# EAGLE design Rat (EAGLE 9.2.2)
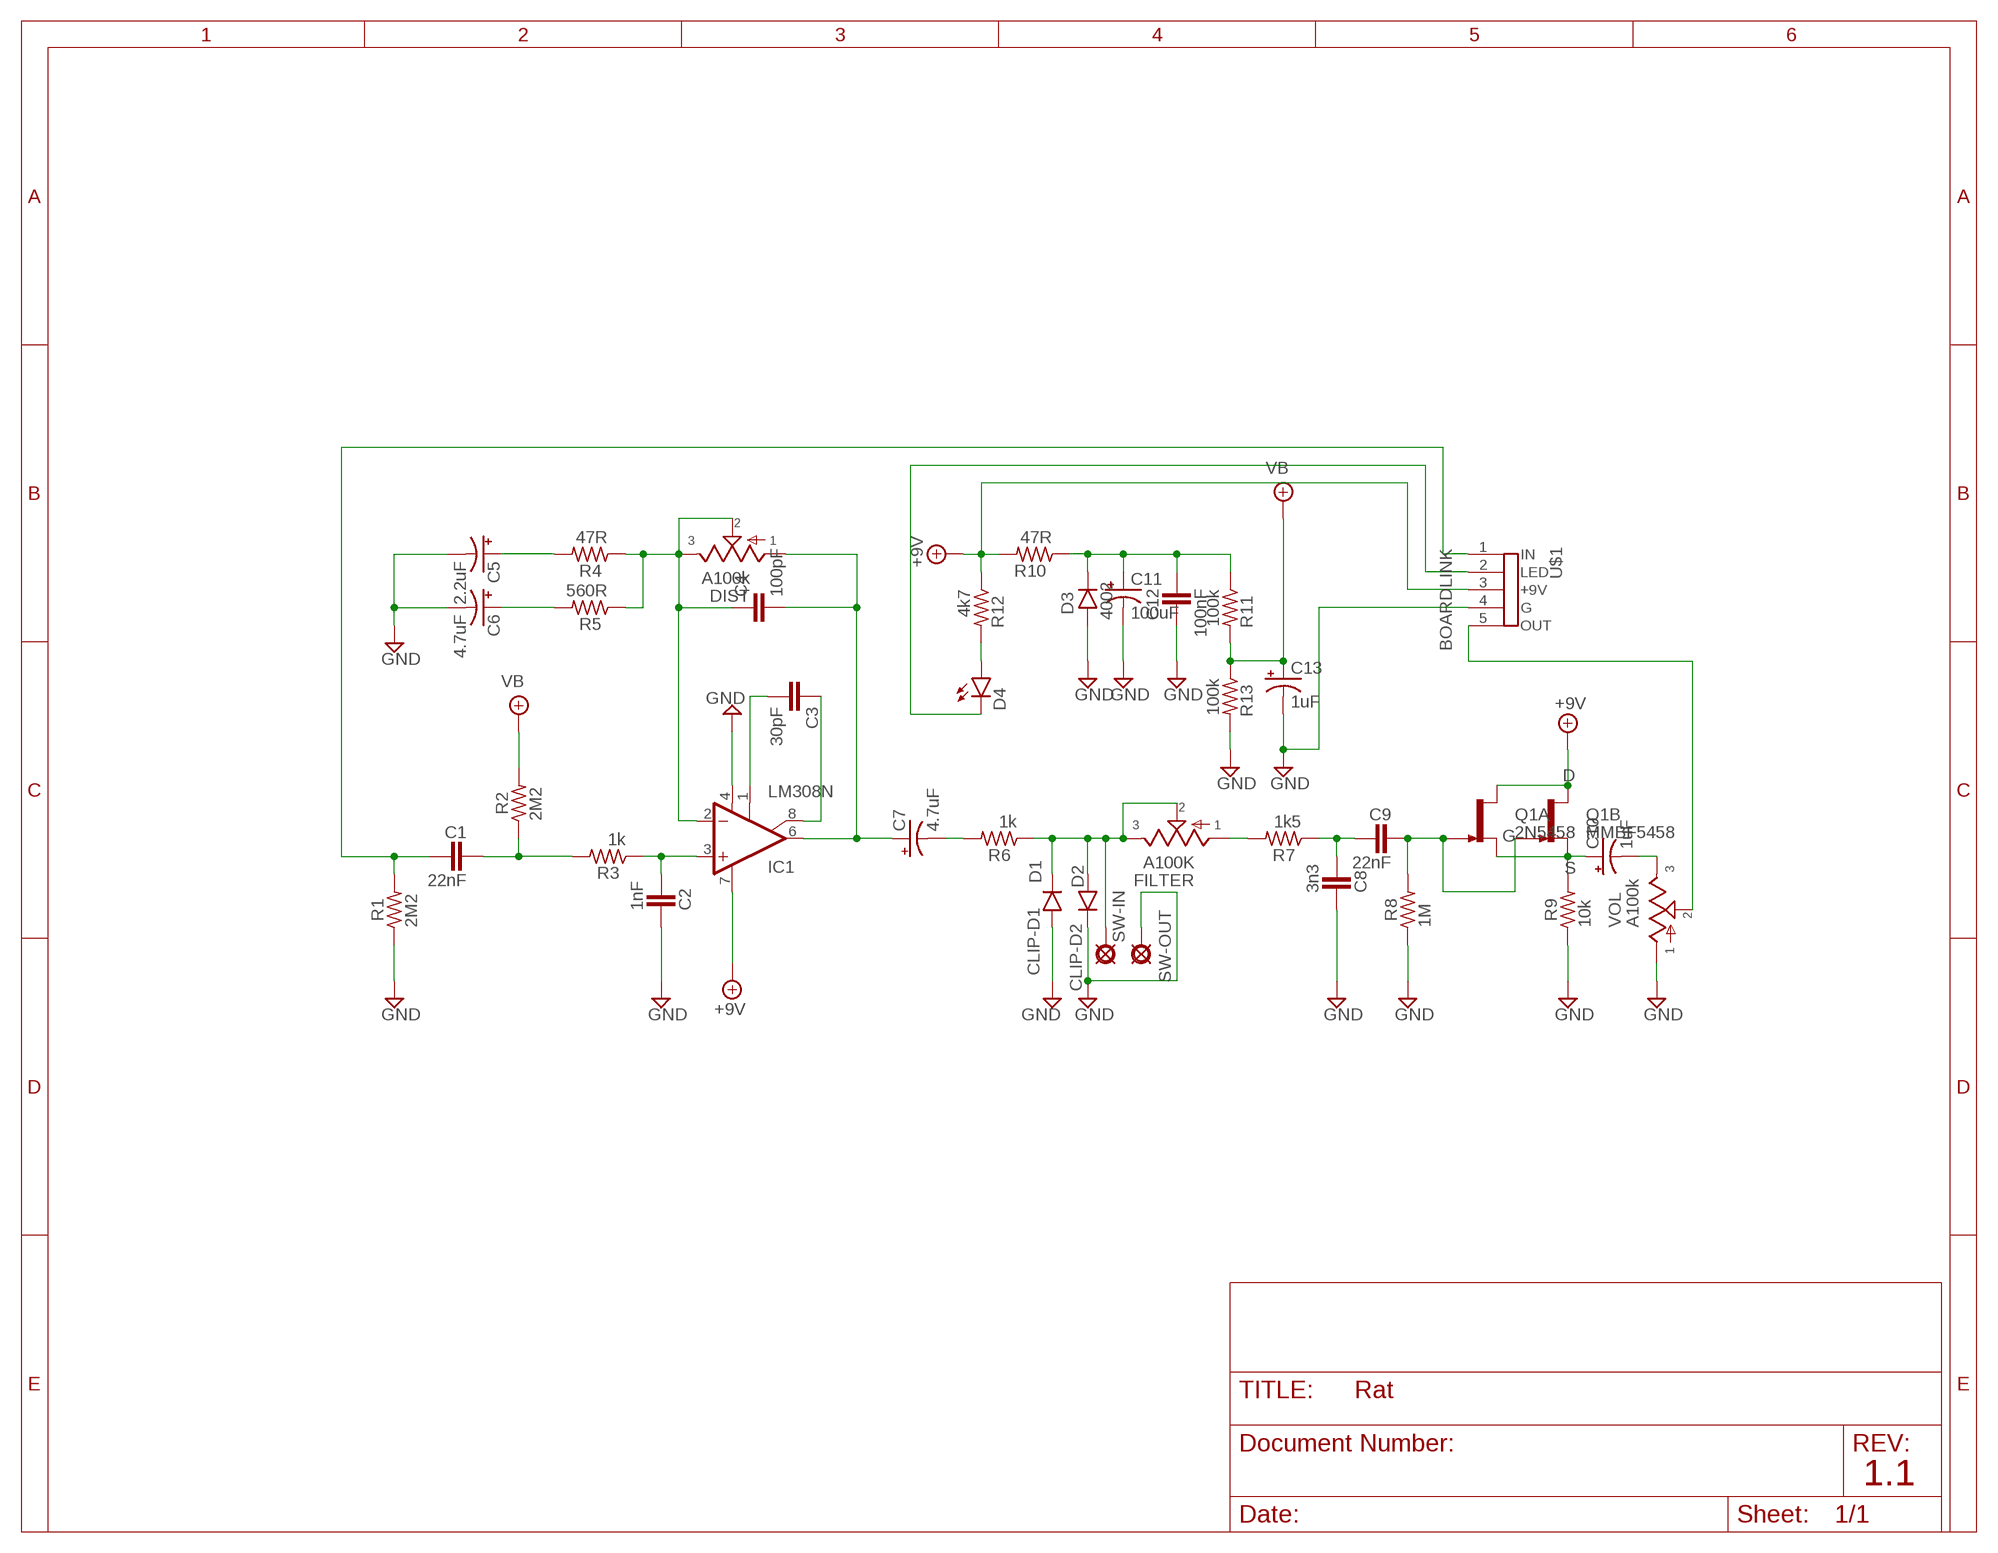
[diagram p0: schematic, sheet 1]

## Parts
C1  22nF  072X0252  [072X025]
C2  1nF  072X0252  [072X025]
C3  30pF  050X030_0251  [050X030_025]
C4  100pF  050X030_0251  [050X030_025]
C5  2.2uF  0501  [050_020_1]
C6  4.7uF  0501  [050_020_1]
C7  4.7uF  0501  [050_020_1]
C8  3n3  072X0252  [072X025]
C9  22nF  072X0252  [072X025]
C10  1uF  0501  [050_020_1]
C11  100uF  0801  [080_035_1]
C12  100nF  072X0252  [072X025]
C13  1uF  0501  [050_020_1]
D1  CLIP-D1  1N914.3  [DO35-3]
D2  CLIP-D2  1N914.3  [DO35-3]
D3  4002  1N400X.3  [DO41-3]
D4  LED3MM  [LED3MM]
DIST  A100k  POT16MM  [16MM]
FILTER  A100K  POT16MM  [16MM]
IC1  LM308N  [DIL08]
Q1A  2N5458  [TO92-]
Q1B  MMBF5458  [SOT23]
R1  2M2  6MM.3  [R0207/3]
R2  2M2  6MM.3  [R0207/3]
R3  1k  6MM.3  [R0207/3]
R4  47R  6MM.3  [R0207/3]
R5  560R  6MM.3  [R0207/3]
R6  1k  6MM.3  [R0207/3]
R7  1k5  6MM.3  [R0207/3]
R8  1M  6MM.3  [R0207/3]
R9  10k  6MM.3  [R0207/3]
R10  47R  6MM.3  [R0207/3]
R11  100k  6MM.3  [R0207/3]
R12  4k7  6MM.3  [R0207/3]
R13  100k  6MM.3  [R0207/3]
SW-IN  PAD  [SQUARE]
SW-OUT  PADO  [ROUND]
U$1  BOARDLINK  [BOARDLINK]
VOL  A100k  POT16MM  [16MM]

## Nets
+9V: IC1.7(V+) Q1A.3(D) Q1B.1(D) R10.2 R12.1 U$1.3(+9V)
GND: C2.2 C5.- C6.- C8.2 C11.- C12.1 C13.- D1.A D2.C D3.A IC1.4(V-) R1.1 R8.1 R9.1 R13.2 SW-OUT.1(PAD) U$1.4(G) VOL.1
N$1: C1.2 R2.1 R3.2
N$2: C2.1 IC1.3(+IN) R3.1
N$3: D4.A R12.2
N$4: C5.+ R4.2
N$5: C6.+ R5.2
N$6: C4.1 DIST.2 DIST.3 IC1.2(-IN) R4.1 R5.1
N$7: C3.2 IC1.1(CMP1)
N$8: C3.1 IC1.8(CMP2)
N$9: C4.2 C7.+ DIST.1 IC1.6(OUT)
N$10: C7.- R6.2
N$11: D1.C D2.A FILTER.2 FILTER.3 R6.1 SW-IN.1(PAD)
N$12: C8.1 C9.1 R7.1
N$13: C9.2 Q1A.1(G) Q1B.3(G) R8.2
N$14: FILTER.1 R7.2
N$15: C10.+ Q1A.2(S) Q1B.2(S) R9.2
N$16: C10.- VOL.3
N$17: D4.K(C) U$1.2(LED)
N$18: C1.1 R1.2 U$1.1(IN)
N$19: U$1.5(OUT) VOL.2
N$21: C11.+ C12.2 D3.C R10.1 R11.1
VB: C13.+ R2.2 R11.2 R13.1

## Notes on the sheet
- 1.1

## Library data of the parts
C1 C2 C8 C9 C12 = mb_caps-box:072X025: 1000pF - 0.47uF WIMA MKP2 63, 100V: 1000pF - 0.015uF; MKS2 50V: 0.33 - 0.47uF; 63V: 1000pF - 0.22uF;
C3 C4 = mb_caps-ceramic:050X030_025: 47 - 120pF Xicon Ceramic Disc 2.5mm lead spacing
C5-C7 C10 C13 = mb_caps-electro:050: 0.22 - 100uF Xicon values at Mouser.com: 10V: 10 - 100uF; 16V: 2.2 - 47uF; 25V: 0.47 - 47uF; 50V: 0.22 - 22uF
C11 = mb_caps-electro:080: 47 - 470uF Xicon values at Mouser.com 10V: 330, 470uF; 16V: 220, 330uF; 25V: 220uF; 50V: 47, 100uF
D1 D2 = mb_diodes:1N914: Fast Switching Diode DO-35 glass case a.k.a. 1N4148
D3 = mb_diodes:1N400X: Rectifier Diodes often used in power supply to prevent damage from reverse polarization
D4 = mb_diodes:LED
DIST FILTER VOL = mb_pots:POT: Potentiometers the arrow indicates the clockwise motion of th wiper (lug 2) fully counter clockwise there is no resistance between lugs 1 and 2 fully clockwise the resistance between lugs 1 and 2 is the value of the pot
IC1 = mb_ics:LM308: OP AMP
Q1A = xc_library:2N5458: N-CHANNEL JFET
Q1B = xc_library:MMBF5458: SMD 5458
R1-R13 = mb_resistors:6MM: 6mm Resistors Leads spaced 1-6 holes apart for 0.1" perfboard. Suitable for 1/4 watt resistors.
SW-IN SW-OUT = mb_supply:PAD: PAD use this package for pads with any purpose, including input, output, send or return various pad shapes: round, square, octogonal, long, and long offset
U$1 = xc_library:BOARDLINK

## Board
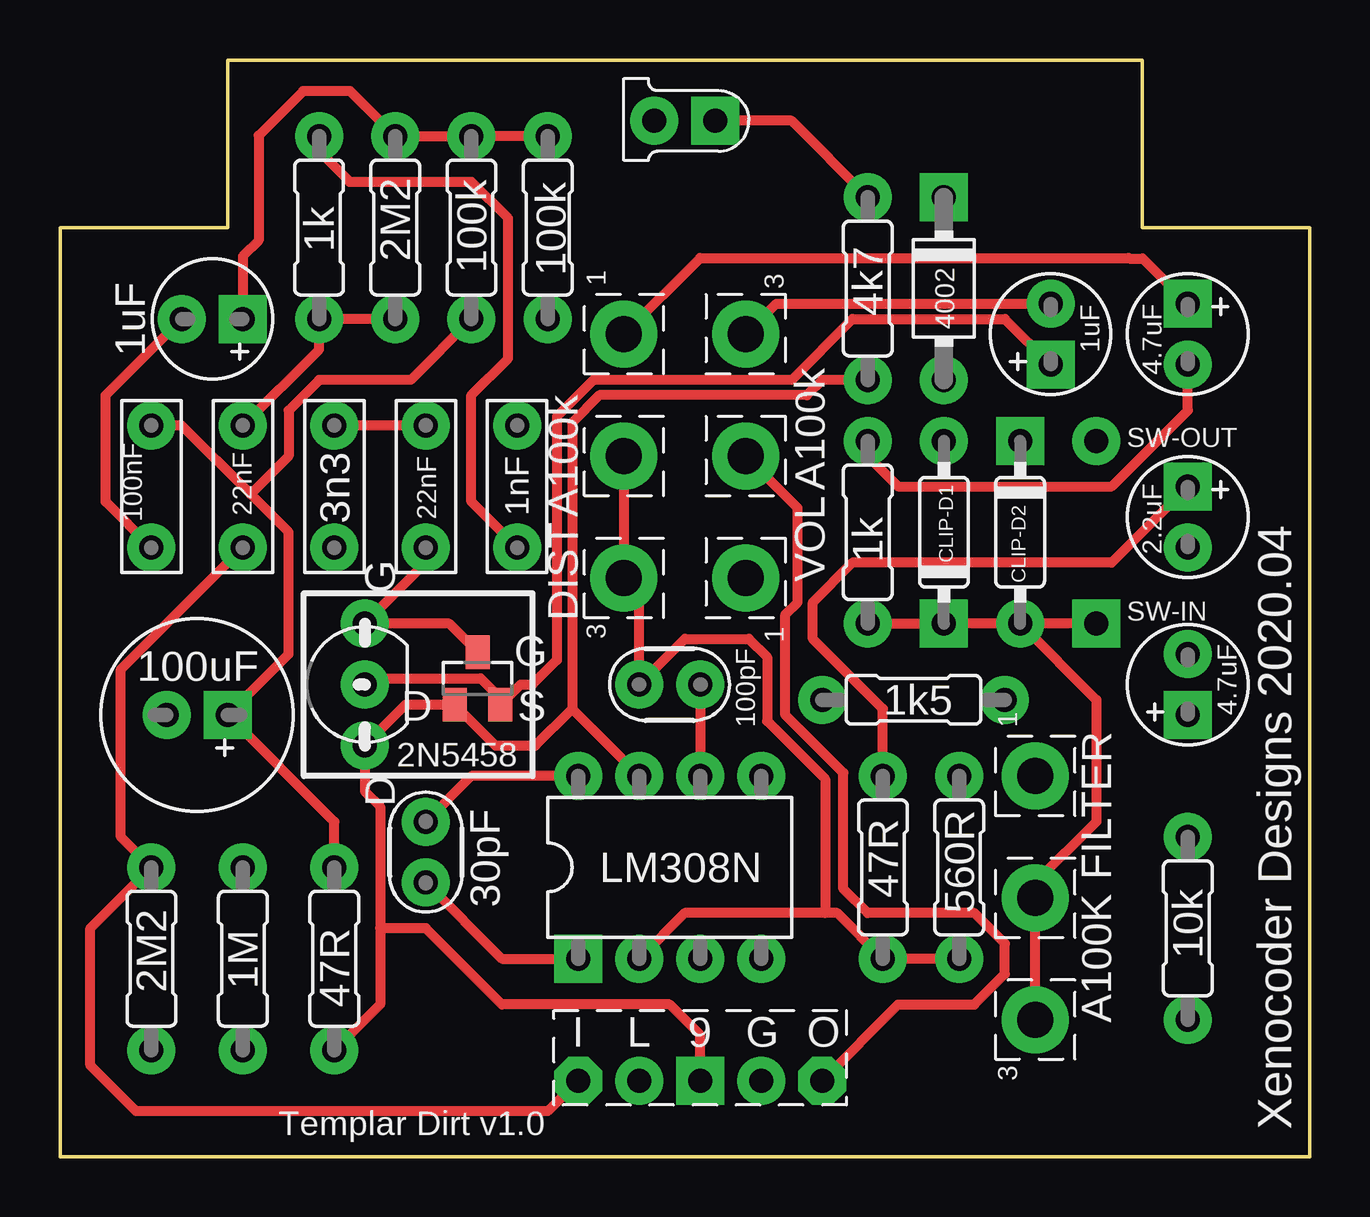
[diagram p1: board, top side]
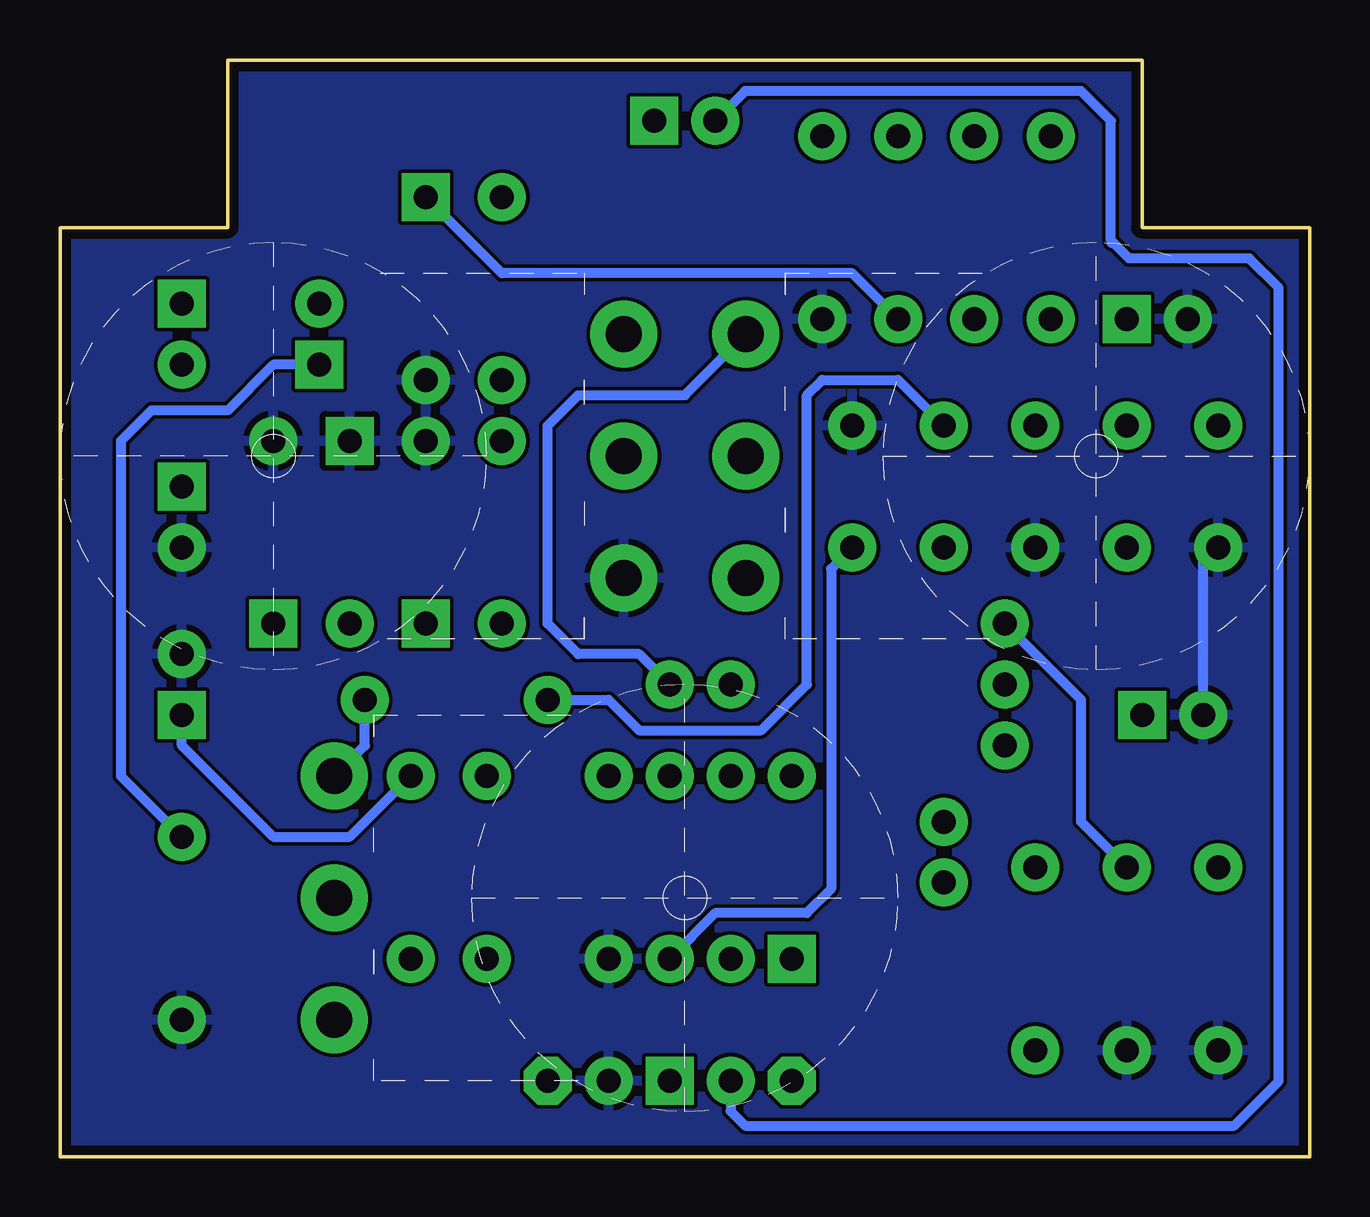
[diagram p2: board, bottom side, seen from below]

Size 52.07 x 45.72 mm. Coordinates in mm from the lower left corner, seen from the top.
Outline: 0,0 52.07,0 52.07,38.73 45.09,38.73 45.09,45.72 6.99,45.72 6.99,38.73 0,38.73 0,0
Copper layers (1*16): Top 0.035559375mm / dielectric 1.6mm / Bottom 0.035559375mm
Design rules "oshpark-2layer": minimum track width 6mil, minimum drill 10mil, track to track 6mil, track to pad 6mil, pad to pad 6mil, via to via 6mil, smd to smd 6mil, copper to edge 15mil, drill to drill 6mil, minimum pad ring 5mil, minimum via ring 5mil, stop-mask expansion 2.5mil, vias tented up to drill 0mil, thermal gap 10mil

### Footprints (pad centres in the part's own frame; a part is rotated, then mirrored left to right if it is on the bottom)
072X025 = drill 1 pad 2: 1 -2.54,0; 2 2.54,0
050X030_025 = drill 1 pad 2: 1 -1.27,0; 2 1.27,0
050_020_1 = drill 1 pad 2 square: + -1.27,0 | drill 1 pad 2: - 1.27,0
080_035_1 = drill 1 pad 2 square: + -1.27,0 | drill 1 pad 2: - 1.27,0
DO35-3 = drill 1 pad 2: A 3.81,0 | drill 1 pad 2 square: C -3.81,0
DO41-3 = drill 1 pad 2: A 3.81,0 | drill 1 pad 2 square: C -3.81,0
LED3MM = drill 1 pad 2 square: A -1.27,0 | drill 1 pad 2: K 1.27,0
16MM = drill 1.5 pad 2.794: 1 5.08,0; 2 0,0; 3 -5.08,0
DIL08 = drill 1 pad 2 square: 1 -3.81,-3.81 | drill 1 pad 2: 2 -1.27,-3.81; 3 1.27,-3.81; 4 3.81,-3.81; 5 3.81,3.81; 6 1.27,3.81; 7 -1.27,3.81; 8 -3.81,3.81
TO92- = drill 1 pad 2: 1 2.54,0; 2 0,0; 3 -2.54,0
SOT23 = smd 1 x 1.4: 1 -0.95,-1.1; 2 0.95,-1.1; 3 0,1.1
R0207/3 = drill 1 pad 2: 1 -3.81,0; 2 3.81,0
SQUARE = drill 1 pad 2 square: 1 0,0
ROUND = drill 1 pad 2: 1 0,0
BOARDLINK = drill 1 pad 2 octagon: 1 -2.54,0; 5 7.62,0 | drill 1 pad 2: 2 0,0; 4 5.08,0 | drill 1 pad 2 square: 3 2.54,0

### Placement (x,y rotation side)
C1  7.62,27.94 90 top
C2  19.05,27.94 90 top
C3  15.24,12.7 270 top
C4  25.4,19.68 0 top
C5  46.99,26.67 270 top
C6  46.99,19.68 90 top
C7  46.99,34.29 270 top
C8  11.43,27.94 270 top
C9  15.24,27.94 270 top
C10  41.27,34.29 90 top
C11  5.71,18.41 180 top
C12  3.81,27.94 90 top
C13  6.35,34.92 180 top
D1  36.83,26.04 90 top
D2  40.01,26.04 270 top
D3  36.83,36.2 270 top
D4  26.04,43.18 180 top
DIST  23.5,29.21 90 top
FILTER  40.64,10.79 90 top
IC1  25.4,12.06 0 top
Q1A  12.7,19.68 90 top
Q1B  17.4,19.94 0 top
R1  3.81,8.26 90 top
R2  13.97,38.73 90 top
R3  10.79,38.73 270 top
R4  34.29,12.06 90 top
R5  37.47,12.06 90 top
R6  33.66,26.04 90 top
R7  35.56,19.05 0 top
R8  7.62,8.26 90 top
R9  46.99,9.53 90 top
R10  11.43,8.26 270 top
R11  17.14,38.73 90 top
R12  33.66,36.2 90 top
R13  20.32,38.73 270 top
SW-IN  43.18,22.23 0 top
SW-OUT  43.18,29.84 0 top
U$1  24.13,3.17 0 top
VOL  28.57,29.21 270 top

### Tracks (layer width: path | path; a pad name or v marks a point on that pad's centre or on a via)
+9V
  Top 0.406: IC1.7 21.34,18.67 | 13.34,9.53 13.34,14.61 12.7,15.24 Q1A.3 14.39,18.84 Q1B.1 18.14,17.14 19.81,17.14 21.34,18.67 | 13.34,9.53 13.34,6.35 R10.2 | U$1.3 26.67,5.08 25.4,6.35 18.41,6.35 15.24,9.53 13.34,9.53 | R12.1 31.75,32.38 31.11,31.75 22.48,31.75 21.34,30.61 21.34,18.67
GND
  Top 0.406: C12.1 1.91,27.3 1.91,31.75 C13.-
  Bottom 0.406: C11.- 4.45,24.77 C12.1
  pour Bottom: 0,0 52.07,0 52.07,38.73 45.09,38.73 45.09,45.72 6.99,45.72 6.99,38.73 0,38.73
N$1
  Top 0.406: C1.2 10.79,33.66 R3.2 R2.1
N$2
  Top 0.406: R3.1 10.79,41.91 12.06,40.64 17.14,40.64 18.67,39.12 18.67,33.27 17.14,31.75 17.14,27.3 C2.1
  Bottom 0.406: C2.1 19.94,24.51 19.94,11.18 20.95,10.16 24.77,10.16 IC1.3
N$3
  Top 0.406: R12.2 30.48,43.18 D4.A
N$4
  Top 0.406: R4.2 34.29,18.67 31.37,21.59 31.37,23.11 33.02,24.77 43.81,24.77 C5.+
N$5
  Bottom 0.406: R5.2 40.01,13.34 43.18,13.34 46.99,17.14 C6.+
N$6
  Top 0.406: DIST.2 DIST.3 24.13,23.5 C4.1 26.04,21.59 28.7,21.59 29.46,20.83 29.46,18.16 31.88,15.75 31.88,10.16 | R5.1 R4.1 32.38,10.16 31.88,10.16 | 31.88,10.16 26.04,10.16 IC1.2
N$7
  Top 0.406: C3.2 18.41,8.26 IC1.1
N$8
  Top 0.406: IC1.8 17.14,15.88 C3.1
N$9
  Top 0.406: DIST.1 26.67,37.47 44.52,37.47 44.55,37.44 45.11,37.44 C7.+ | C4.2 IC1.6
  Bottom 0.406: C4.2 27.94,20.95 30.48,20.95 31.75,22.23 31.75,30.48 30.48,31.75 26.04,31.75 DIST.1
N$10
  Top 0.406: R6.2 33.66,29.21 34.92,27.94 43.81,27.94 46.99,31.11 C7.-
N$11
  Top 0.406: FILTER.3 FILTER.2 40.64,11.43 43.18,13.97 43.18,19.05 D2.A | R6.1 D1.C D2.A | SW-IN.1 D2.A
N$12
  Top 0.406: C9.1 C8.1
  Bottom 0.406: R7.1 29.21,19.05 27.94,17.78 22.86,17.78 20.95,19.68 20.95,31.75 20.32,32.38 17.14,32.38 C9.1
N$13
  Top 0.406: C9.2 15.24,24.77 Q1A.1 16.21,22.23 Q1B.3
  Bottom 0.406: R8.2 9.53,13.97 9.53,19.05 Q1A.1
N$14
  Bottom 0.406: FILTER.1 39.37,17.14 R7.2
N$15
  Top 0.406: C10.+ 39.37,34.92 33.02,34.92 30.48,32.38 22.23,32.38 20.7,30.86 20.7,20.7 19.68,19.68 19.2,19.68 18.49,18.98 | Q1B.2 18.49,18.98 | Q1A.2 12.95,19.94 17.53,19.94 18.49,18.98
  Bottom 0.406: C10.+ 43.18,33.02 45.09,31.11 48.26,31.11 49.53,29.84 49.53,15.88 R9.2
N$16
  Top 0.406: VOL.3 29.84,35.56 C10.-
N$17
  Bottom 0.406: U$1.2 24.13,1.91 23.52,1.29 3.15,1.29 1.29,3.15 1.29,36.22 2.52,37.44 7.52,37.44 8.18,38.1 8.26,38.1 8.26,38.17 8.28,38.2 8.28,43.18 9.53,44.42 23.52,44.42 D4.K
N$18
  Top 0.406: C1.1 2.54,20.32 2.54,13.34 R1.2 1.27,9.53 1.27,3.81 3.17,1.91 20.32,1.91 U$1.1
N$19
  Top 0.406: U$1.5 34.92,6.35 38.1,6.35 39.37,7.62 39.37,8.89 38.1,10.16 33.66,10.16 32.64,11.18 32.64,16 30.23,18.41 30.23,22.61 30.73,23.11 30.73,27.05 VOL.2
N$21
  Top 0.406: 7.94,27.62 9.53,26.04 9.53,20.95 C11.+ 11.43,13.97 R10.1 | 7.94,27.62 5.08,30.48 C12.2 | R11.1 14.61,32.38 10.79,32.38 9.53,31.11 9.53,29.21 7.94,27.62
  Bottom 0.406: R11.1 19.05,36.83 33.66,36.83 D3.C
VB
  Top 0.406: R13.1 R11.2 R2.2 12.09,44.42 10.13,44.42 8.28,42.57 8.28,38.2 7.62,37.54 C13.+

### Text on the board
tNames: Templar Dirt v1.0 | Xenocoder Designs 2020.04